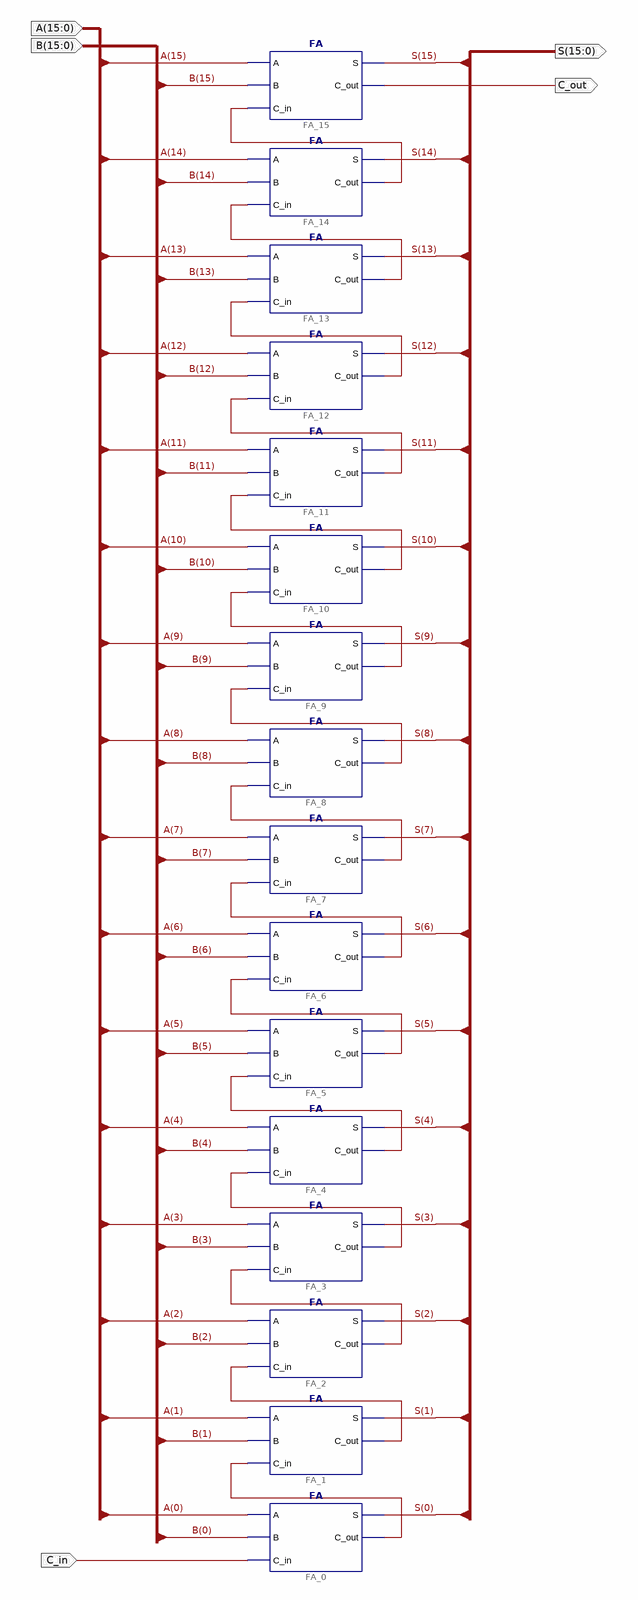
[diagram p0: schematic sheet 1]
// Xilinx ISE schematic FA_16bits.sch (virtex6) as structural Verilog: 16 symbols, 5 ports
module FA_16bits (
  input  C_in,
  input  [15:0] A,
  input  [15:0] B,
  output C_out,
  output [15:0] S
);

  wire XLXN_1, XLXN_2, XLXN_3, XLXN_5, XLXN_6, XLXN_7, XLXN_8, XLXN_9, XLXN_10, XLXN_11, XLXN_12, XLXN_13,
       XLXN_14, XLXN_15, XLXN_16;

  FA FA_14 (.A(A[14]), .B(B[14]), .C_in(XLXN_2), .C_out(XLXN_1), .S(S[14]));
  FA FA_13 (.A(A[13]), .B(B[13]), .C_in(XLXN_3), .C_out(XLXN_2), .S(S[13]));
  FA FA_12 (.A(A[12]), .B(B[12]), .C_in(XLXN_5), .C_out(XLXN_3), .S(S[12]));
  FA FA_11 (.A(A[11]), .B(B[11]), .C_in(XLXN_6), .C_out(XLXN_5), .S(S[11]));
  FA FA_10 (.A(A[10]), .B(B[10]), .C_in(XLXN_7), .C_out(XLXN_6), .S(S[10]));
  FA FA_9 (.A(A[9]), .B(B[9]), .C_in(XLXN_8), .C_out(XLXN_7), .S(S[9]));
  FA FA_8 (.A(A[8]), .B(B[8]), .C_in(XLXN_9), .C_out(XLXN_8), .S(S[8]));
  FA FA_7 (.A(A[7]), .B(B[7]), .C_in(XLXN_10), .C_out(XLXN_9), .S(S[7]));
  FA FA_6 (.A(A[6]), .B(B[6]), .C_in(XLXN_11), .C_out(XLXN_10), .S(S[6]));
  FA FA_15 (.A(A[15]), .B(B[15]), .C_in(XLXN_1), .C_out(C_out), .S(S[15]));
  FA FA_5 (.A(A[5]), .B(B[5]), .C_in(XLXN_12), .C_out(XLXN_11), .S(S[5]));
  FA FA_4 (.A(A[4]), .B(B[4]), .C_in(XLXN_13), .C_out(XLXN_12), .S(S[4]));
  FA FA_3 (.A(A[3]), .B(B[3]), .C_in(XLXN_14), .C_out(XLXN_13), .S(S[3]));
  FA FA_2 (.A(A[2]), .B(B[2]), .C_in(XLXN_15), .C_out(XLXN_14), .S(S[2]));
  FA FA_1 (.A(A[1]), .B(B[1]), .C_in(XLXN_16), .C_out(XLXN_15), .S(S[1]));
  FA FA_0 (.A(A[0]), .B(B[0]), .C_in(C_in), .C_out(XLXN_16), .S(S[0]));
endmodule
